# EAGLE schematic door_lock_v1.1 (EAGLE 9.5.2)

## Sheet 1 of 2
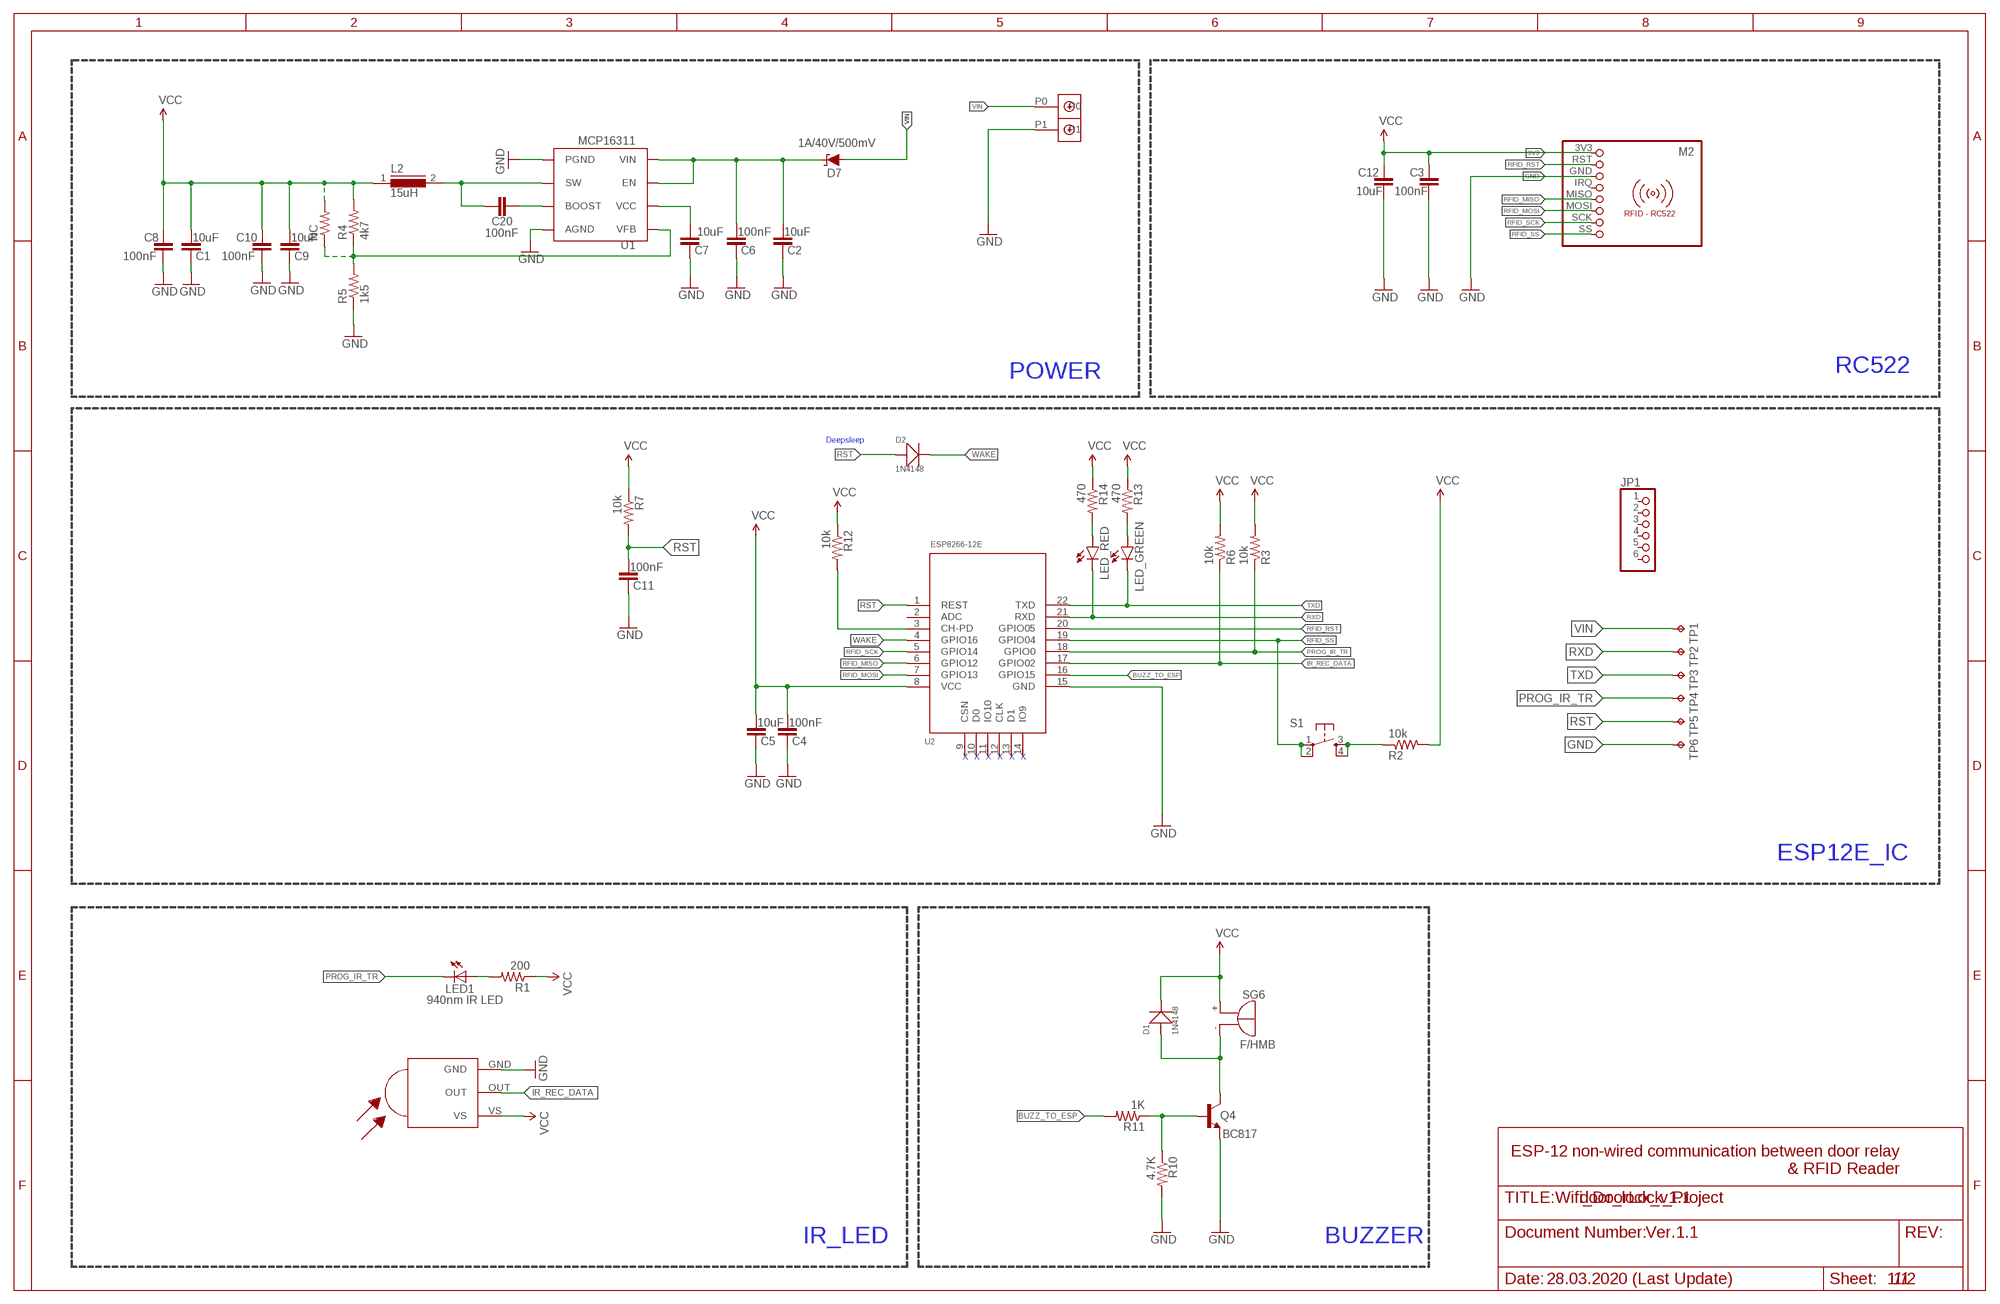
[diagram p0: schematic, sheet 1]

### Parts
C1  10uF  C-EUC0805  [C0805]
C2  10uF  C-EUC0805  [C0805]
C3  100nF  C-EUC0805  [C0805]
C4  100nF  C-EUC0805  [C0805]
C5  10uF  C-EUC0805  [C0805]
C6  100nF  C-EUC0805  [C0805]
C7  10uF  C-EUC0805  [C0805]
C8  100nF  C-EUC0805  [C0805]
C9  10uF  C-EUC0805  [C0805]
C10  100nF  C-EUC0805  [C0805]
C11  100nF  C-EUC0805  [C0805]
C12  10uF  C-EUC0805  [C0805]
C20  100nF  C-EUC0805  [C0805]
D1  1N4148  SMD-DIODE-SWITCH-1N4148(LL-34)  [LL-34]
D2  1N4148  SMD-DIODE-SWITCH-1N4148(LL-34)  [LL-34]
D7  1A/40V/500mV  DIODE-SCHOTTKY-SS14  [SMA-DIODE]
JP1  PINHD-1X6  [1X06]
L2  15uH  DR74  [DR74]
LED1  940nm IR LED  LEDIRL80A  [IRL80A]
LED_GREEN  LED3MM  [LED3MM]
LED_RED  LED3MM  [LED3MM]
M2  RFID-RC522  [RFID-RC522]
NC  SPARKFUN_RESISTOR0805-RES  [SPARKFUN_0805]
Q4  BC817  TRANSISTOR_BJT_NPN-SOT-23-BCE  [SOT-23]
R1  200  SPARKFUN_RESISTOR0805-RES  [SPARKFUN_0805]
R2  10k  SPARKFUN_RESISTOR0805-RES  [SPARKFUN_0805]
R3  10k  SPARKFUN_RESISTOR0805-RES  [SPARKFUN_0805]
R4  4k7  SPARKFUN_RESISTOR0805-RES  [SPARKFUN_0805]
R5  1k5  SPARKFUN_RESISTOR0805-RES  [SPARKFUN_0805]
R6  10k  SPARKFUN_RESISTOR0805-RES  [SPARKFUN_0805]
R7  10k  SPARKFUN_RESISTOR0805-RES  [SPARKFUN_0805]
R10  4.7K  R-US_M0805  [M0805]
R11  1K  R-US_M0805  [M0805]
R12  10k  SPARKFUN_RESISTOR0805-RES  [SPARKFUN_0805]
R13  470  SPARKFUN_RESISTOR0805-RES  [SPARKFUN_0805]
R14  470  SPARKFUN_RESISTOR0805-RES  [SPARKFUN_0805]
S1  FLASH  TAC_SWITCHPTH  [TACTILE-PTH]
SG6  F/HMB  [F/HMB]
TP1  TPTP20SQ  [TP20SQ]
TP2  TPTP20SQ  [TP20SQ]
TP3  TPTP20SQ  [TP20SQ]
TP4  TPTP20SQ  [TP20SQ]
TP5  TPTP20SQ  [TP20SQ]
TP6  TPTP20SQ  [TP20SQ]
U1  MCP16311  [MSOP8]
U2  ESP8266-12E  MOUDLE-WIFI-ESP8266-12E/ESP-12E(22P-24X16MM)  [LGA22-2.0-24X16MM]
U$1  DBCONN-1X2  [DBCONN-1X2]
U$3  TSOP18  TSOP38238  [TSOP-382]

### Nets
3V3: C3.1 C12.1 M2.3V3 ; supply symbol labelled VCC
BUZZ_TO_ESP: R11.2 U2.16(GPIO15)
CH_PD: R12.2 U2.3(CH-PD)
GND: C1.1 C2.1 C3.2 C4.1 C5.1 C6.1 C7.1 C8.2 C9.1 C10.2 C11.1 C12.2 M2.GND Q4.3(E) R5.1 R10.2 TP6.TP U1.AGND U1.PGND U2.15(GND) U$1.P1 U$3.GND
IR_REC_DATA: R6.1 U2.17(GPIO02) U$3.OUT
N$1: LED_RED.A R14.2
N$2: LED1.A R1.2
N$3: Q4.1(B) R10.1 R11.1
N$4: D1.A(+) Q4.2(C) SG6.-
N$6: R2.1 S1.3 S1.4
N$8: C20.2 L2.2 U1.SW
N$9: C20.1 U1.BOOST
N$11: C7.2 U1.VCC
N$12: C2.2 C6.2 D7.C U1.EN U1.VIN
N$13: LED_GREEN.A R13.2
N$14: NC.1 R4.1 R5.2 U1.VFB
PROG_IR_TR: LED1.K(C) R3.1 TP4.TP U2.18(GPIO0)
RFID_MISO: M2.MISO U2.6(GPIO12)
RFID_MOSI: M2.MOSI U2.7(GPIO13)
RFID_RST: M2.RST U2.20(GPIO05)
RFID_SCK: M2.SCK U2.5(GPIO14)
RFID_SS: M2.SS S1.1 S1.2 U2.19(GPIO04)
RST: C11.2 D2.A(+) R7.2 TP5.TP U2.1(REST)
RXD: LED_RED.K(C) TP2.TP U2.21(RXD)
TXD: LED_GREEN.K(C) TP3.TP U2.22(TXD)
VCC: C1.2 C4.2 C5.2 C8.1 C9.2 C10.1 D1.C(-) L2.1 NC.2 R1.1 R2.2 R3.2 R4.2 R6.2 R7.1 R12.1 R13.1 R14.1 SG6.+ U2.8(VCC) U$3.VS
VIN: D7.A TP1.TP U$1.P0
WAKE: D2.C(-) U2.4(GPIO16)
Unconnected: JP1.1 JP1.2 JP1.3 JP1.4 JP1.5 JP1.6 M2.IRQ U2.2(ADC) U2.9(CSN) U2.10(D0) U2.11(IO10) U2.12(CLK) U2.13(D1) U2.14(IO9)

### Notes on the sheet
- POWER | RC522
- Deepsleep
- X | X | X | X | X | X
- ESP12E_IC
- ESP-12 non-wired communication between door relay
  & RFID Reader
- Wifi_DoorLock_Project
- Ver.1.1
- IR_LED | BUZZER
- 28.03.2020 (Last Update) | 1/1

## Sheet 2 of 2

## Library data of the parts
C1-C12 C20 = rcl:C-EU: CAPACITOR, European symbol; SPICEPREFIX: C
D1 D2 = Seeed-Diode-2016:SMD-DIODE-SWITCH-1N4148(LL-34): 304040016; MPN: 1N4148
D7 = SparkFun-DiscreteSemi:DIODE-SCHOTTKY: Schottky diode A Schottky diode is a semiconductor diode which has a low forward voltage drop and a very fast switching action.; PROD_ID: DIO-08053
JP1 = pinhead:PINHD-1X6: PIN HEADER
L2 = inductors:DR74: High Power Density, High Efficiency, Shielded Inductors Source: coiltronics_dr_series.pdf; SPICEPREFIX: L
LED1 = adafruit:LED: LED
LED_GREEN LED_RED = led:LED: LED
M2 = mfrc522-module:RFID-RC522: RFID-RC522 MFRC-522 based breakout board
NC R1-R7 R12-R14 = antduino:SPARKFUN_RESISTOR: Resistor Basic schematic elements and footprints for 0603, 1206, and PTH resistors.
Q4 = dp_devices:TRANSISTOR_BJT_NPN: Most commonly used is SOT23-BEC
R10 R11 = adafruit:R-US_: RESISTOR, American symbol
S1 = SparkFun:TAC_SWITCH: Momentary Switch Button commonly used for reset or general input. Spark Fun Electronics SKU : COM-00097
SG6 = buzzer:F/HMB: BUZZER Source: Buerklin; OC_FARNELL: unknown; OC_NEWARK: unknown
TP1-TP6 = testpad:TP: Test pad
U1 = microchip:MCP16311
U2 = Seeed-OPL-Moudle:MOUDLE-WIFI-ESP8266-12E/ESP-12E(22P-24X16MM): 317060015; MPN: ESP8266-12E/ESP-12E; VALUE: ESP8266-12E/ESP-12E
U$1 = Terminal Block Connector:DBCONN-1X2
U$3 = TSOP38238:TSOP38238: 38 kHz 45 m 2.5-5.5 V Through Hole IR Receiver Module for Remote Control System; DESCRIPTION: Remote Receiver Sensor, 38.0kHz 45m Through Hole; DIGI-KEY_PART_NUMBER: 751-1227-ND; DIGI-KEY_PURCHASE_URL: https://www.digikey.com/product-detail/en/vishay-semiconductor-opto-division/TSOP38238/751-1227-ND/1681362?utm_source=snapeda&utm_medium=aggregator&utm_campaign=symbol; MF: Vishay; MP: TSOP38238; PACKAGE: None